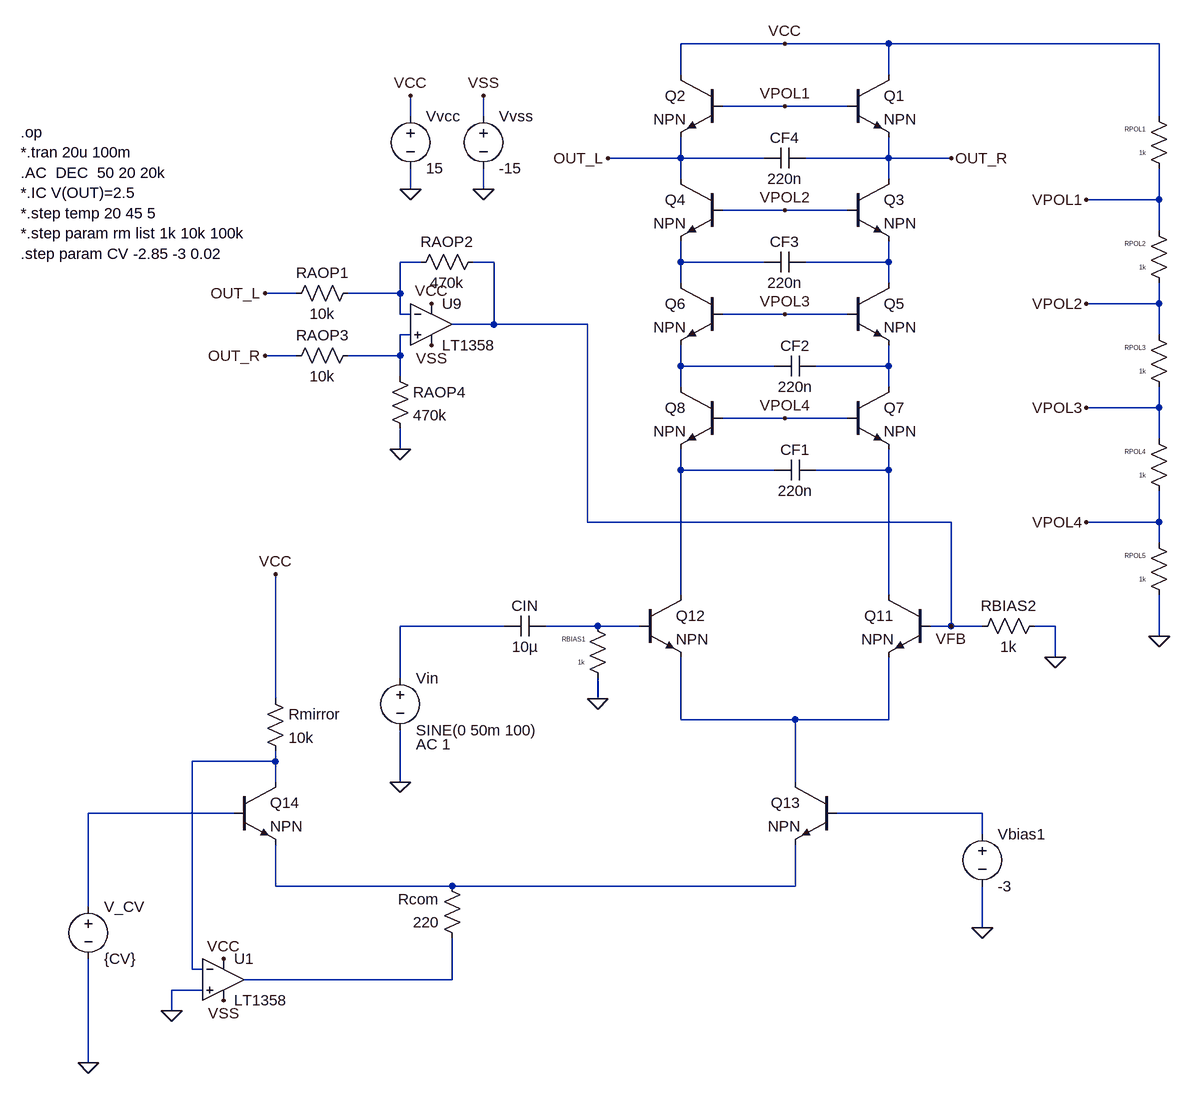
[diagram p0: schematic ltspice-simulation-Moog-ladder-VCF.asc]
ltspice-simulation-Moog-ladder-VCF.asc, the LTspice schematic file:
Version 4
SHEET 1 1716 1712
WIRE -192 -608 -352 -608
WIRE -32 -608 -192 -608
WIRE 384 -608 -32 -608
WIRE -352 -560 -352 -608
WIRE -32 -560 -32 -608
WIRE -192 -512 -288 -512
WIRE -96 -512 -192 -512
WIRE -768 -496 -768 -528
WIRE -656 -496 -656 -528
WIRE 384 -496 384 -608
WIRE -352 -432 -352 -464
WIRE -352 -432 -464 -432
WIRE -224 -432 -352 -432
WIRE -32 -432 -32 -464
WIRE -32 -432 -160 -432
WIRE 64 -432 -32 -432
WIRE -352 -400 -352 -432
WIRE -32 -400 -32 -432
WIRE -768 -384 -768 -416
WIRE -656 -384 -656 -416
WIRE 384 -368 384 -416
WIRE 384 -368 272 -368
WIRE -192 -352 -288 -352
WIRE -96 -352 -192 -352
WIRE 384 -320 384 -368
WIRE -752 -272 -784 -272
WIRE -640 -272 -672 -272
WIRE -352 -272 -352 -304
WIRE -224 -272 -352 -272
WIRE -32 -272 -32 -304
WIRE -32 -272 -160 -272
WIRE -352 -240 -352 -272
WIRE -32 -240 -32 -272
WIRE -944 -224 -992 -224
WIRE -784 -224 -784 -272
WIRE -784 -224 -864 -224
WIRE 384 -208 384 -240
WIRE 384 -208 272 -208
WIRE -784 -192 -784 -224
WIRE -768 -192 -784 -192
WIRE -192 -192 -288 -192
WIRE -96 -192 -192 -192
WIRE -640 -176 -640 -272
WIRE -640 -176 -704 -176
WIRE -496 -176 -640 -176
WIRE -768 -160 -784 -160
WIRE 384 -160 384 -208
WIRE -944 -128 -992 -128
WIRE -784 -128 -784 -160
WIRE -784 -128 -864 -128
WIRE -352 -112 -352 -144
WIRE -208 -112 -352 -112
WIRE -32 -112 -32 -144
WIRE -32 -112 -144 -112
WIRE -784 -96 -784 -128
WIRE -352 -80 -352 -112
WIRE -32 -80 -32 -112
WIRE 384 -48 384 -80
WIRE 384 -48 272 -48
WIRE -192 -32 -288 -32
WIRE -96 -32 -192 -32
WIRE 384 0 384 -48
WIRE -784 16 -784 -16
WIRE -352 48 -352 16
WIRE -208 48 -352 48
WIRE -32 48 -32 16
WIRE -32 48 -144 48
WIRE -496 128 -496 -176
WIRE 64 128 -496 128
WIRE 384 128 384 80
WIRE 384 128 272 128
WIRE 384 160 384 128
WIRE -352 240 -352 48
WIRE -32 240 -32 48
WIRE -624 288 -784 288
WIRE -480 288 -560 288
WIRE -416 288 -480 288
WIRE 64 288 64 128
WIRE 64 288 32 288
WIRE 112 288 64 288
WIRE 224 288 192 288
WIRE 384 304 384 240
WIRE 224 336 224 288
WIRE -784 368 -784 288
WIRE -976 400 -976 208
WIRE -480 400 -480 368
WIRE -352 432 -352 336
WIRE -176 432 -352 432
WIRE -32 432 -32 336
WIRE -32 432 -176 432
WIRE -976 496 -976 480
WIRE -976 496 -1104 496
WIRE -976 528 -976 496
WIRE -784 528 -784 448
WIRE -176 528 -176 432
WIRE -1040 576 -1264 576
WIRE 112 576 -112 576
WIRE 112 608 112 576
WIRE -976 688 -976 624
WIRE -704 688 -976 688
WIRE -176 688 -176 624
WIRE -176 688 -704 688
WIRE -1264 720 -1264 576
WIRE 112 752 112 688
WIRE -1104 816 -1104 496
WIRE -1088 816 -1104 816
WIRE -704 832 -704 768
WIRE -704 832 -1024 832
WIRE -1088 848 -1136 848
WIRE -1136 880 -1136 848
WIRE -1264 960 -1264 800
FLAG -768 -384 0
FLAG -768 -528 VCC
FLAG -656 -384 0
FLAG -656 -528 VSS
FLAG -784 16 0
FLAG -784 528 0
FLAG -736 -208 VCC
FLAG -736 -144 VSS
FLAG -192 -608 VCC
FLAG -192 -512 VPOL1
FLAG -192 -352 VPOL2
FLAG -192 -192 VPOL3
FLAG -192 -32 VPOL4
FLAG 64 -432 OUT_R
FLAG -464 -432 OUT_L
FLAG -480 400 0
FLAG 224 336 0
FLAG 384 304 0
FLAG 272 -208 VPOL2
FLAG 272 -48 VPOL3
FLAG 272 128 VPOL4
FLAG -992 -128 OUT_R
FLAG -992 -224 OUT_L
FLAG 64 288 VFB
FLAG 272 -368 VPOL1
FLAG -1264 960 0
FLAG -1136 880 0
FLAG 112 752 0
FLAG -1056 800 VCC
FLAG -1056 864 VSS
FLAG -976 208 VCC
DATAFLAG -176 432 "$"
DATAFLAG -32 144 "$"
DATAFLAG -352 160 "$"
DATAFLAG 320 -368 "$"
DATAFLAG 320 -208 "$"
DATAFLAG 320 -48 "$"
DATAFLAG 320 128 "$"
DATAFLAG 16 -432 "$"
DATAFLAG -112 -272 "$"
DATAFLAG -112 -112 "$"
DATAFLAG -320 -432 "$"
DATAFLAG -304 -272 "$"
DATAFLAG -304 -112 "$"
DATAFLAG -480 288 "$"
DATAFLAG -496 688 "$"
DATAFLAG -1072 496 "$"
DATAFLAG -1216 576 "$"
DATAFLAG 32 576 "$"
DATAFLAG -896 832 "$"
DATAFLAG -976 304 "$"
SYMBOL voltage -768 -512 R0
WINDOW 123 0 0 Left 2
WINDOW 39 0 0 Left 2
SYMATTR InstName Vvcc
SYMATTR Value 15
SYMBOL voltage -656 -512 R0
WINDOW 123 0 0 Left 2
WINDOW 39 0 0 Left 2
SYMATTR InstName Vvss
SYMATTR Value -15
SYMBOL LT1358 -736 -240 R0
SYMATTR InstName U9
SYMBOL voltage -784 352 R0
WINDOW 123 24 118 Left 2
WINDOW 39 0 0 Left 2
SYMATTR Value2 AC 1
SYMATTR InstName Vin
SYMATTR Value SINE(0 50m 100)
SYMBOL npn -96 -560 R0
SYMATTR InstName Q1
SYMBOL npn -288 -560 M0
SYMATTR InstName Q2
SYMBOL npn -96 -400 R0
SYMATTR InstName Q3
SYMBOL npn -288 -400 M0
SYMATTR InstName Q4
SYMBOL npn -96 -240 R0
SYMATTR InstName Q5
SYMBOL npn -288 -240 M0
SYMATTR InstName Q6
SYMBOL npn -96 -80 R0
SYMATTR InstName Q7
SYMBOL npn -288 -80 M0
SYMATTR InstName Q8
SYMBOL npn 32 240 M0
SYMATTR InstName Q11
SYMBOL npn -416 240 R0
SYMATTR InstName Q12
SYMBOL npn -112 528 M0
SYMATTR InstName Q13
SYMBOL npn -1040 528 R0
SYMATTR InstName Q14
SYMBOL res 208 272 R90
WINDOW 0 0 56 VBottom 2
WINDOW 3 32 56 VTop 2
SYMATTR InstName RBIAS2
SYMATTR Value 1k
SYMBOL res -464 384 R180
WINDOW 0 36 76 Left 0
WINDOW 3 36 40 Left 0
SYMATTR InstName RBIAS1
SYMATTR Value 1k
SYMBOL res 400 -400 R180
WINDOW 0 36 76 Left 0
WINDOW 3 36 40 Left 0
SYMATTR InstName RPOL1
SYMATTR Value 1k
SYMBOL res 400 -224 R180
WINDOW 0 36 76 Left 0
WINDOW 3 36 40 Left 0
SYMATTR InstName RPOL2
SYMATTR Value 1k
SYMBOL res 400 -64 R180
WINDOW 0 36 76 Left 0
WINDOW 3 36 40 Left 0
SYMATTR InstName RPOL3
SYMATTR Value 1k
SYMBOL res 400 96 R180
WINDOW 0 36 76 Left 0
WINDOW 3 36 40 Left 0
SYMATTR InstName RPOL4
SYMATTR Value 1k
SYMBOL res 400 256 R180
WINDOW 0 36 76 Left 0
WINDOW 3 36 40 Left 0
SYMATTR InstName RPOL5
SYMATTR Value 1k
SYMBOL res -960 -208 R270
WINDOW 0 32 56 VTop 2
WINDOW 3 0 56 VBottom 2
SYMATTR InstName RAOP1
SYMATTR Value 10k
SYMBOL res -768 -256 R270
WINDOW 0 32 56 VTop 2
WINDOW 3 0 56 VBottom 2
SYMATTR InstName RAOP2
SYMATTR Value 470k
SYMBOL res -800 -112 R0
SYMATTR InstName RAOP4
SYMATTR Value 470k
SYMBOL res -848 -144 R90
WINDOW 0 0 56 VBottom 2
WINDOW 3 32 56 VTop 2
SYMATTR InstName RAOP3
SYMATTR Value 10k
SYMBOL cap -560 272 R90
WINDOW 0 0 32 VBottom 2
WINDOW 3 32 32 VTop 2
SYMATTR InstName CIN
SYMATTR Value 10µ
SYMBOL cap -144 32 R90
WINDOW 0 0 32 VBottom 2
WINDOW 3 32 32 VTop 2
SYMATTR InstName CF1
SYMATTR Value 220n
SYMBOL cap -144 -128 R90
WINDOW 0 0 32 VBottom 2
WINDOW 3 32 32 VTop 2
SYMATTR InstName CF2
SYMATTR Value 220n
SYMBOL cap -160 -288 R90
WINDOW 0 0 32 VBottom 2
WINDOW 3 32 32 VTop 2
SYMATTR InstName CF3
SYMATTR Value 220n
SYMBOL cap -160 -448 R90
WINDOW 0 0 32 VBottom 2
WINDOW 3 32 32 VTop 2
SYMATTR InstName CF4
SYMATTR Value 220n
SYMBOL voltage -1264 704 R0
WINDOW 123 0 0 Left 2
WINDOW 39 0 0 Left 2
SYMATTR InstName V_CV
SYMATTR Value {CV}
SYMBOL LT1358 -1056 768 R0
SYMATTR InstName U1
SYMBOL res -688 784 R180
WINDOW 0 36 76 Left 2
WINDOW 3 36 40 Left 2
SYMATTR InstName Rcom
SYMATTR Value 220
SYMBOL res -992 384 R0
SYMATTR InstName Rmirror
SYMATTR Value 10k
SYMBOL voltage 112 592 R0
WINDOW 123 0 0 Left 2
WINDOW 39 0 0 Left 2
SYMATTR InstName Vbias1
SYMATTR Value -3
TEXT -1368 -472 Left 2 !.op\n*.tran 20u 100m\n.AC  DEC  50 20 20k\n*.IC V(OUT)=2.5\n*.step temp 20 45 5\n*.step param rm list 1k 10k 100k\n.step param CV -2.85 -3 0.02

The netlist it stands for:
* ltspice-simulation-Moog-ladder-VCF.asc
Vvcc VCC 0 15
Vvss VSS 0 -15
XU9 N004 N001 VCC VSS VFB LT1357  ; LT1358, pins In+ In- V+ V- OUT
Vin N009 0 SINE(0 50m 100) AC 1
Q1 VCC VPOL1 OUT_R 0 NPN
Q2 VCC VPOL1 OUT_L 0 NPN
Q3 OUT_R VPOL2 N003 0 NPN
Q4 OUT_L VPOL2 N002 0 NPN
Q5 N003 VPOL3 N006 0 NPN
Q6 N002 VPOL3 N005 0 NPN
Q7 N006 VPOL4 N008 0 NPN
Q8 N005 VPOL4 N007 0 NPN
Q11 N008 VFB N011 0 NPN
Q12 N007 N010 N011 0 NPN
Q13 N011 N014 N015 0 NPN
Q14 N012 N013 N015 0 NPN
RBIAS2 0 VFB 1k
RBIAS1 0 N010 1k
RPOL1 VPOL1 VCC 1k
RPOL2 VPOL2 VPOL1 1k
RPOL3 VPOL3 VPOL2 1k
RPOL4 VPOL4 VPOL3 1k
RPOL5 0 VPOL4 1k
RAOP1 OUT_L N001 10k
RAOP2 N001 VFB 470k
RAOP4 N004 0 470k
RAOP3 N004 OUT_R 10k
CIN N010 N009 10µ
CF1 N008 N007 220n
CF2 N006 N005 220n
CF3 N003 N002 220n
CF4 OUT_R OUT_L 220n
V_CV N013 0 {CV}
XU1 0 N012 VCC VSS N016 LT1357  ; LT1358, pins In+ In- V+ V- OUT
Rcom N016 N015 220
Rmirror VCC N012 10k
Vbias1 N014 0 -3
.model NPN NPN
.model PNP PNP
.lib standard.bjt
.op
*.tran 20u 100m
.AC  DEC  50 20 20k
*.IC V(OUT)=2.5
*.step temp 20 45 5
*.step param rm list 1k 10k 100k
.step param CV -2.85 -3 0.02
.lib LTC.lib
.backanno
.end